# EAGLE design TRV_RFM23_V0.1 (EAGLE 6.3)
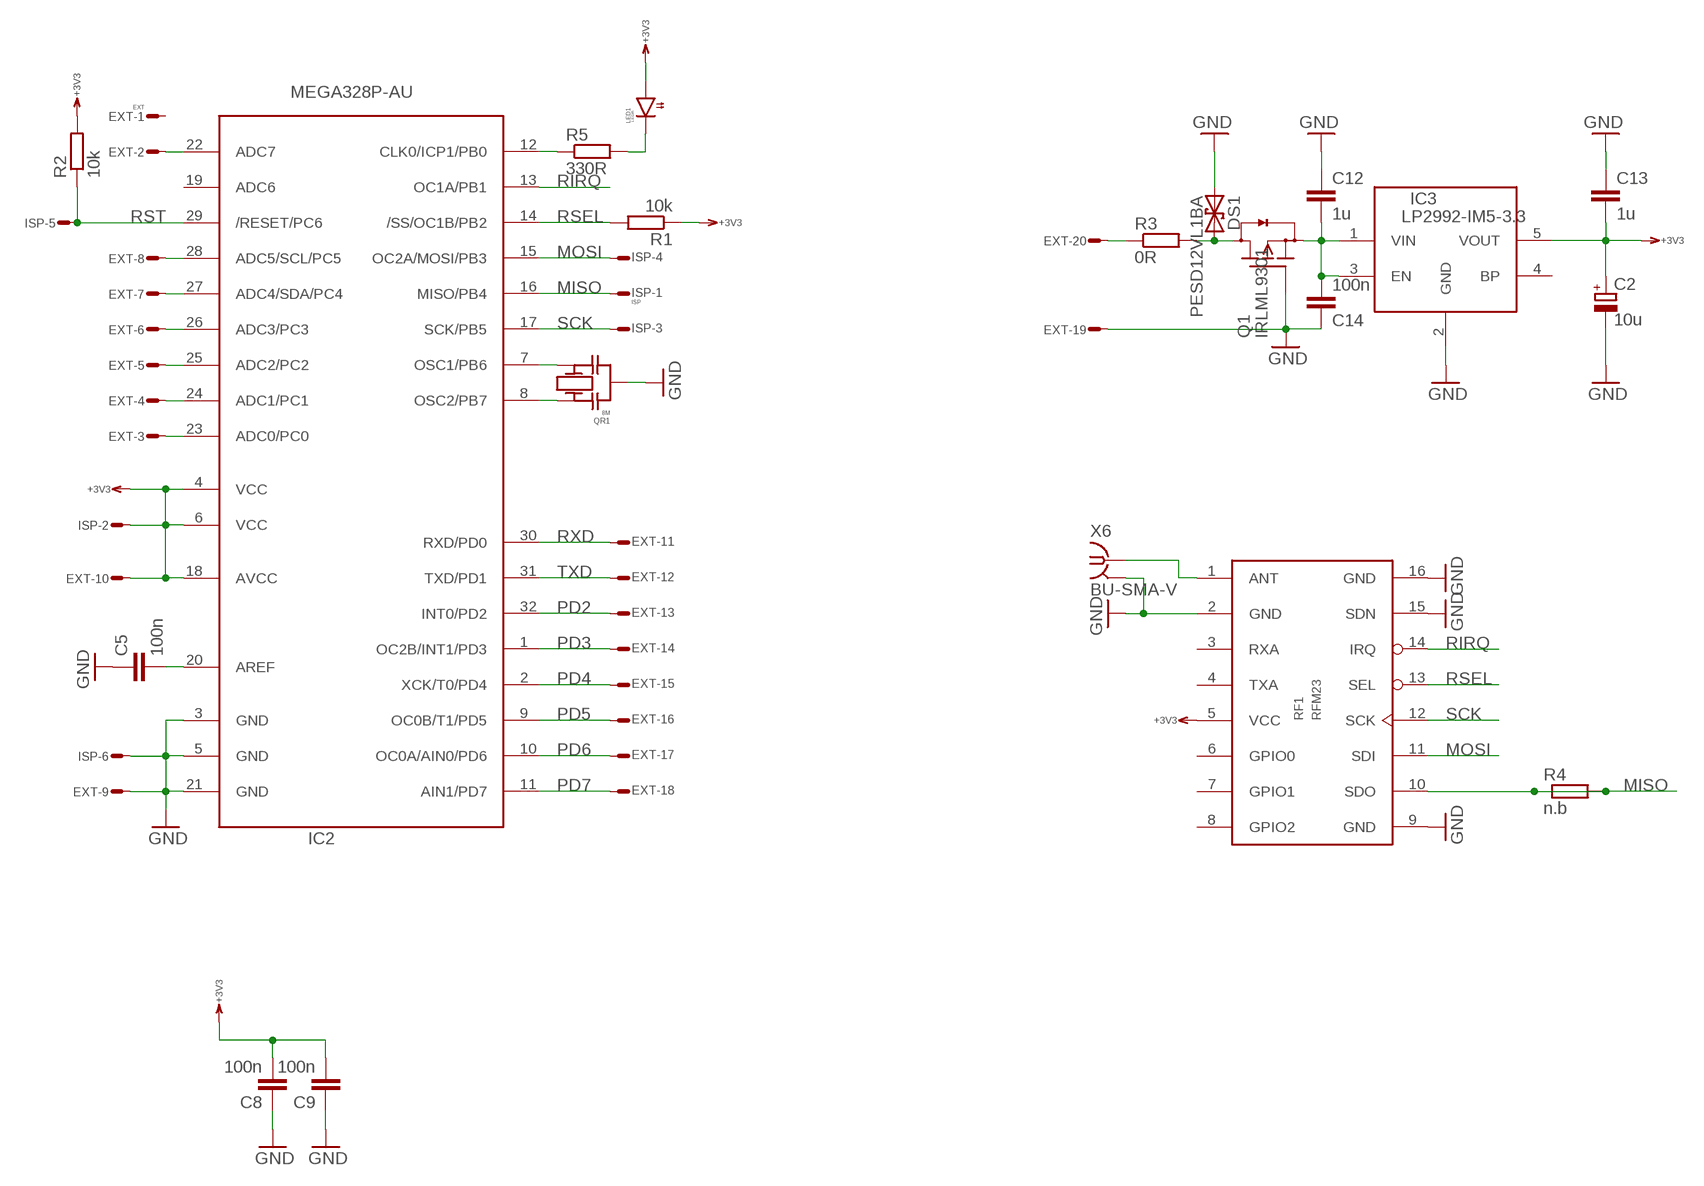
[diagram p0: schematic, sheet 1]

## Parts
C2  10u  C_POLSMCB  [SMC_B]
C5  100n  C0603  [0603]
C8  100n  C0603  [0603]
C9  100n  C0603  [0603]
C12  1u  C0603  [0603]
C13  1u  C0603  [0603]
C14  100n  C0603  [0603]
DS1  PESD12VL1BA  TVS-U323  [SOD323]
EXT  EXT  ML20SE  [ML20S]
IC2  MEGA328P-AU  MEGA168PA  [TQFP32-08]
IC3  LP2992-IM5-3.3  LDO  [SOT23-5]
ISP  ISP  ML6ES  [ML6S]
LED1  LEDR  LED0805  [0805]
Q1  IRLML9301  FET-PDSOT23  [SOT23]
QR1  8M  QRCR  [CR]
R1  10k  R0603  [0603]
R2  10k  R0603  [0603]
R3  0R  R0603  [0603]
R4  n.b  R0603  [0603]
R5  330R  R0603  [0603]
RF1  RFM23  RFM22S1  [RFM23B]
X6  BU-SMA-V  [BU-SMA-V]

## Nets
+3V3: C2.+ C8.2 C9.2 C13.2 EXT.10 IC2.4(VCC) IC2.6(VCC) IC2.18(AVCC) IC3.5(VOUT) ISP.2 LED1.C(A) R1.1 R2.2 RF1.5(VCC)
GND: C2.- C5.1 C8.1 C9.1 C12.1 C13.1 C14.1 DS1.A EXT.9 EXT.19 IC2.3(GND) IC2.5(GND) IC2.21(GND) IC3.2(GND) ISP.6 Q1.1(G) QR1.M RF1.2(GND) RF1.9(GND) RF1.15(SDN) RF1.16(GND) X6.2(GND)
LED: IC2.12(CLK0/ICP1/PB0) R5.1
MISO: IC2.16(MISO/PB4) ISP.1 R4.1 R4.2 RF1.10(SDO)
MOSI: IC2.15(OC2A/MOSI/PB3) ISP.4 RF1.11(SDI)
N$1: RF1.1(ANT) X6.1
N$3: EXT.2 IC2.22(ADC7)
N$5: DS1.C Q1.3(D) R3.2
N$6: C5.2 IC2.20(AREF)
N$7: IC2.8(OSC2/PB7) QR1.1
N$8: IC2.7(OSC1/PB6) QR1.2
N$9: EXT.20 R3.1
N$12: C12.2 C14.2 IC3.1(VIN) IC3.3(EN) Q1.2(S)
N$21: LED1.A(C) R5.2
PC0: EXT.3 IC2.23(ADC0/PC0)
PC1: EXT.4 IC2.24(ADC1/PC1)
PC2: EXT.5 IC2.25(ADC2/PC2)
PC3: EXT.6 IC2.26(ADC3/PC3)
PC4: EXT.7 IC2.27(ADC4/SDA/PC4)
PC5: EXT.8 IC2.28(ADC5/SCL/PC5)
PD2: EXT.13 IC2.32(INT0/PD2)
PD3: EXT.14 IC2.1(OC2B/INT1/PD3)
PD4: EXT.15 IC2.2(XCK/T0/PD4)
PD5: EXT.16 IC2.9(OC0B/T1/PD5)
PD6: EXT.17 IC2.10(OC0A/AIN0/PD6)
PD7: EXT.18 IC2.11(AIN1/PD7)
RIRQ: IC2.13(OC1A/PB1) RF1.14(IRQ)
RSEL: IC2.14(/SS/OC1B/PB2) R1.2 RF1.13(SEL)
RST: IC2.29(/RESET/PC6) ISP.5 R2.1
RXD: EXT.11 IC2.30(RXD/PD0)
SCK: IC2.17(SCK/PB5) ISP.3 RF1.12(SCK)
TXD: EXT.12 IC2.31(TXD/PD1)
Unconnected: EXT.1 IC2.19(ADC6) IC3.4(BP) RF1.3(RXA) RF1.4(TXA) RF1.6(GPIO0) RF1.7(GPIO1) RF1.8(GPIO2)

## Power pins joined to a net without a drawn wire
GND: X6.3(GND) X6.4(GND) X6.5(GND)

## Library data of the parts
C2 = RCL:C_POL: POLARIZED CAPACITOR, European symbol
C5 C8 C9 C12-C14 = RCL:C: Capacitor SMD
DS1 = Diode:TVS-U: DIODE
EXT = Conn:ML20?E: HARTING
IC2 = atmel:MEGA168P: MCU, 4/8/16k, TQFP32
IC3 = DCDC:LDO
ISP = Conn:ML6E: HARTING
LED1 = Optic:LED
Q1 = Transistor:FET-PD
QR1 = QUARTZ:QR
R1-R5 = RCL:R: Resistor SMD
RF1 = RF:RFM22
X6 = Conn:BU-SMA-V: FEMALE SMA CONNECTOR Radiall distributor RS 112-3794; OC_FARNELL: unknown; OC_NEWARK: unknown

## Board
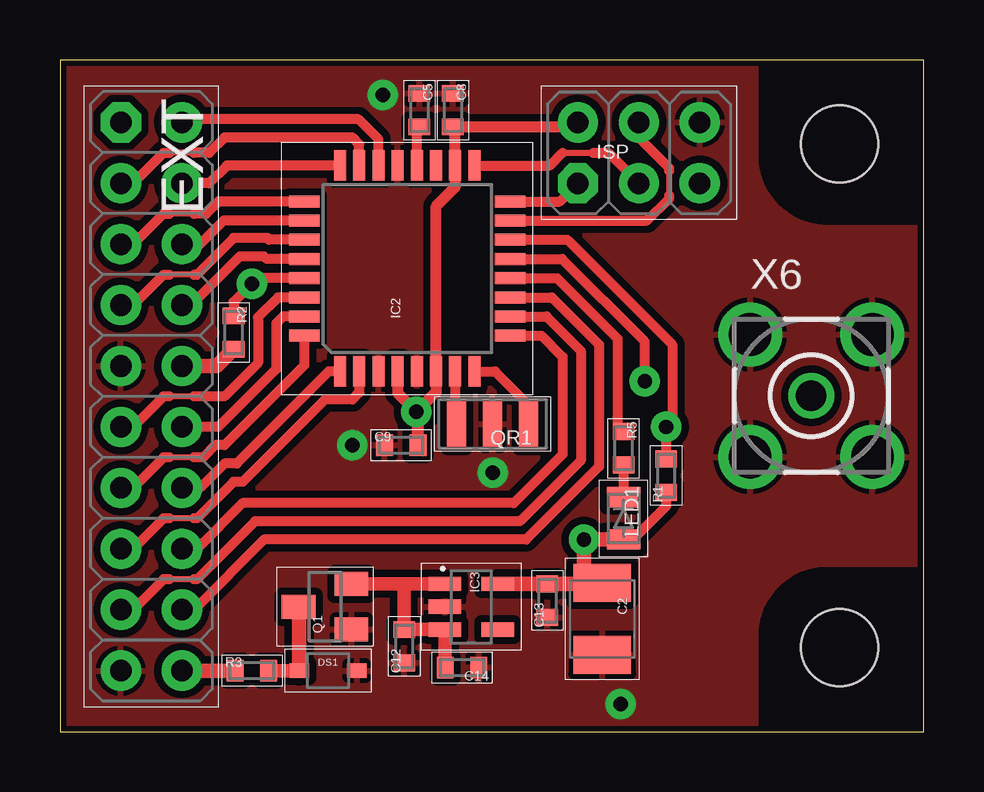
[diagram p1: board, top side]
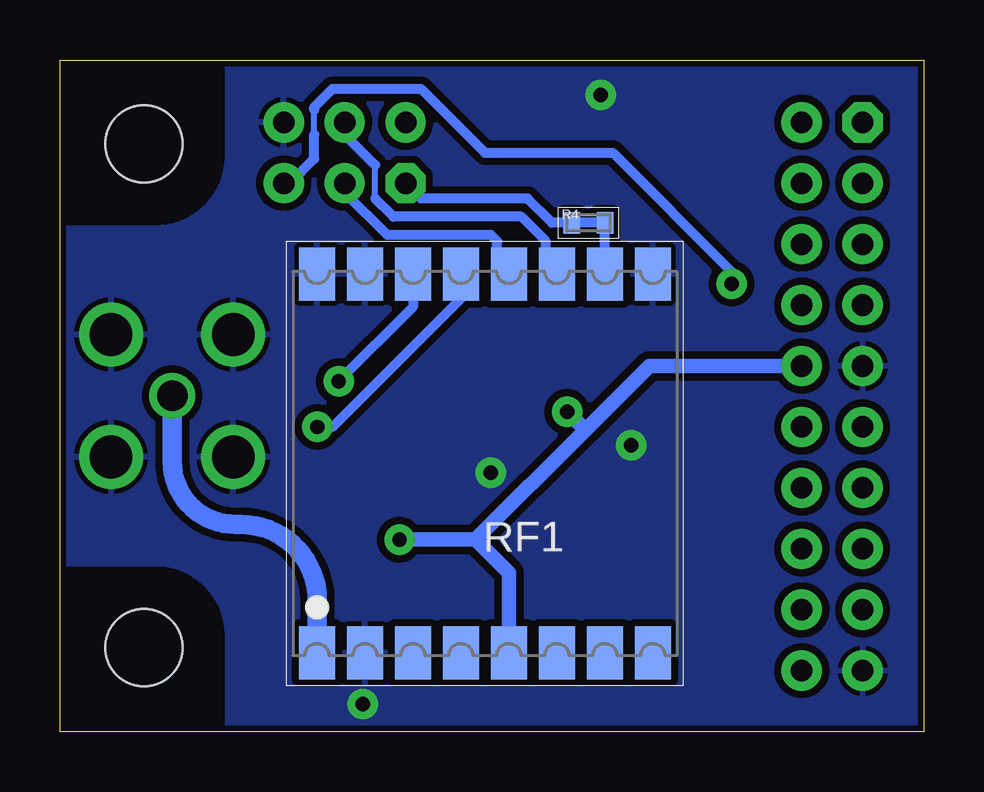
[diagram p2: board, bottom side, seen from below]

Size 36 x 28 mm. Coordinates in mm from the lower left corner, seen from the top.
Outline: 0,0 36,0 36,28 0,28 0,0
Copper layers (1*16): Top 0.035mm / dielectric 1.5mm / Bottom 0.035mm
Design rules "default *": minimum track width 8mil, minimum drill 0.3mm, track to track 12mil, track to pad 12mil, pad to pad 10mil, via to via 12mil, smd to smd 10mil, copper to edge 10mil, drill to drill 8mil, minimum pad ring 5mil, minimum via ring 8mil, stop-mask expansion 4mil, vias tented up to drill 25mil, thermal gap 8mil
Holes 3.2 mm at 32.5,24.5 32.5,3.5

### Footprints (pad centres in the part's own frame; a part is rotated, then mirrored left to right if it is on the bottom)
SMC_B = smd 1.6 x 2.4: + -1.5,0; - 1.5,0
0603 = smd 0.7 x 0.9: 1 -0.697,0; 2 0.697,0
SOD323 = smd 0.8 x 0.6: A 1.2,0; C -1.2,0
ML20S = drill 0.9 pad 1.676 octagon: 1 -11.43,-1.27 | drill 0.9 pad 1.676: 2 -11.43,1.27; 3 -8.89,-1.27; 4 -8.89,1.27; 5 -6.35,-1.27; 6 -6.35,1.27; 7 -3.81,-1.27; 8 -3.81,1.27; 9 -1.27,-1.27; 10 -1.27,1.27; 11 1.27,-1.27; 12 1.27,1.27; 13 3.81,-1.27; 14 3.81,1.27; 15 6.35,-1.27; 16 6.35,1.27; 17 8.89,-1.27; 18 8.89,1.27; 19 11.43,-1.27; 20 11.43,1.27
TQFP32-08 = smd 1.27 x 0.5: 1 -4.293,2.8; 2 -4.293,2; 3 -4.293,1.2; 4 -4.293,0.4; 5 -4.293,-0.4; 6 -4.293,-1.2; 7 -4.293,-2; 8 -4.293,-2.8; 17 4.293,-2.8; 18 4.293,-2; 19 4.293,-1.2; 20 4.293,-0.4; 21 4.293,0.4; 22 4.293,1.2; 23 4.293,2; 24 4.293,2.8 | smd 0.5 x 1.27: 9 -2.8,-4.293; 10 -2,-4.293; 11 -1.2,-4.293; 12 -0.4,-4.293; 13 0.4,-4.293; 14 1.2,-4.293; 15 2,-4.293; 16 2.8,-4.293; 25 2.8,4.293; 26 2,4.293; 27 1.2,4.293; 28 0.4,4.293; 29 -0.4,4.293; 30 -1.2,4.293; 31 -2,4.293; 32 -2.8,4.293
SOT23-5 = smd 0.6 x 1.35: 1 -0.95,-1.101; 2 0,-1.101; 3 0.95,-1.101; 4 0.95,1.101; 5 -0.951,1.101
ML6S = drill 0.9 pad 1.676 octagon: 1 -2.54,-1.27 | drill 0.9 pad 1.676: 2 -2.54,1.27; 3 0,-1.27; 4 0,1.27; 5 2.54,-1.27; 6 2.54,1.27
0805 = smd 0.85 x 1.4: A 0.88,0; C -0.88,0
SOT23 = smd 1 x 1.4: 1 -0.95,-1.1; 2 0.95,-1.1; 3 0,1.1
CR = smd 0.8 x 2: 1 -1.5,0; 2 1.5,0; M 0,0
RFM23B = smd 2.2 x 1.5: 1 -7.9,7; 2 -7.9,5; 3 -7.9,3; 4 -7.9,1; 5 -7.9,-1; 6 -7.9,-3; 7 -7.9,-5; 8 -7.9,-7; 9 7.9,-7; 10 7.9,-5; 11 7.9,-3; 12 7.9,-1; 13 7.9,1; 14 7.9,3; 15 7.9,5; 16 7.9,7
BU-SMA-V = drill 1.27: 1 0,0 | drill 1.778: 2 -2.55,2.55; 3 2.55,2.55; 4 2.55,-2.55; 5 -2.55,-2.55

### Placement (x,y rotation side)
C2  22.61,4.7 270 top
C5  14.99,25.91 270 top
C8  16.38,25.91 270 top
C9  14.22,11.94 0 top
C12  14.35,3.56 90 top
C13  20.32,5.46 90 top
C14  16.76,2.67 180 top
DS1  11.18,2.54 0 top
EXT  3.81,13.97 270 top
IC2  14.48,19.3 90 top
IC3  17.14,5.21 270 top
ISP  24.13,24.13 0 top
LED1  23.5,8.89 90 top
Q1  11.05,5.21 90 top
QR1  18.03,12.83 180 top
R1  25.27,10.67 90 top
R2  7.24,16.64 270 top
R3  8,2.54 0 top
R4  13.97,21.21 0 bottom
R5  23.5,11.81 270 top
RF1  18.29,11.18 90 bottom
X6  31.32,14 0 top

### Tracks (layer width: path | path; a pad name or v marks a point on that pad's centre or on a via)
+3V3  (via drill 0.6 pad 1.27)
  Top 0.406: LED1.C 23.55,8.07 23.94,8.07 25.27,9.4 R1.1
  Top 0.457: IC2.4 14.08,14.12 v14.86,13.34 15.68,14.15 IC2.6 15.68,21.9 16.48,22.7 IC2.18 16.48,25.12 C8.2 21.4,25.21 ISP.2
  Top 0.508: C9.2 14.92,13.27 v14.86,13.34
  Top 0.61: EXT.10 6.54,15.24 R2.2 | 21.97,6.16 C13.2 IC3.5 | 21.97,6.16 22.57,6.16 C2.+ | 21.97,6.16 21.84,6.29 v21.84,8 21.85,8.01 LED1.C
  Bottom 0.61: 14.1,12.57 11.43,15.24 EXT.10 | v21.84,8 18.67,8 | 14.1,12.57 18.67,8 | v14.86,13.34 14.1,12.57 | RF1.5 17.29,6.62 18.67,8
GND  (via drill 0.6 pad 1.27)
  other vias: 18.03,10.79 12.19,11.94 13.46,26.54 23.37,1.14
  pour Top: 0,0 29,0 29,4 arc-90 32,7 36,7 36,21 32,21 arc-90 29,24 29,28 0,28
  pour Bottom: 0,0 29,0 29,4 arc-90 32,7 36,7 36,21 32,21 arc-90 29,24 29,28 0,28
LED
  Top 0.406: IC2.12 20.72,18.9 23.24,16.38 23.24,12.76 R5.1
MISO
  Top 0.406: IC2.16 20.83,22.1 ISP.1
  Bottom 0.406: RF1.10 13.29,21.19 R4.2 R4.1 15.49,21.21 16.51,22.23 20.95,22.23 ISP.1
MOSI
  Top 0.254: 25.4,22.35 25.4,23.37
  Top 0.406: IC2.15 24.48,21.3 25.4,22.23 25.4,22.35 | 25.4,23.37 25.4,23.5 24.13,24.77 ISP.4
  Bottom 0.254: 22.86,22.23 22.86,23.62
  Bottom 0.406: 22.86,22.23 22.1,21.46 16.76,21.46 15.75,20.45 15.75,19.81 15.29,19.35 RF1.11 | 22.86,23.62 24.13,24.89 ISP.4
N$1
  Bottom 0.813: X6.1 31.32,11.26 arc-90 28.7,8.64 28.45,8.64 arc90 25.27,5.46 25.27,3.29 arc90 RF1.1
N$3
  Top 0.406: IC2.22 13.28,24.7 12.45,25.53 5.21,25.53 EXT.2
N$5
  Top 0.559: DS1.C R3.2
  Top 0.61: DS1.C 9.98,5.18 Q1.3
N$6
  Top 0.406: IC2.20 14.88,25.1 C5.2
N$7
  Top 0.406: IC2.8 18.14,15.01 19.43,13.72 19.43,12.93 QR1.1
N$8
  Top 0.406: IC2.7 16.48,12.88 QR1.2
N$9
  Top 0.61: EXT.20 R3.1
N$12
  Top 0.559: IC3.1 14.35,6.16 | 14.35,6.16 Q1.2 | Q1.2 | 14.35,6.16 C12.2 IC3.3 16.04,2.69 C14.2
N$21
  Top 0.406: R5.2 LED1.A
PC0
  Top 0.254: 5.59,24.13 4.57,24.13
  Top 0.406: IC2.23 12.48,24.48 12.19,24.77 6.86,24.77 6.22,24.13 5.59,24.13 | EXT.3 3.05,22.86 4.32,24.13 4.57,24.13
PC1
  Top 0.406: IC2.24 6.96,23.6 6.22,22.86 EXT.4
PC2
  Top 0.254: 5.59,21.59 4.57,21.59
  Top 0.406: 5.59,21.59 6.1,21.59 6.61,22.1 IC2.25 | EXT.5 3.05,20.32 4.32,21.59 4.57,21.59
PC3
  Top 0.406: EXT.6 5.84,20.32 6.83,21.3 IC2.26
PC4
  Top 0.254: 5.59,19.05 4.57,19.05
  Top 0.406: 5.59,19.05 5.71,19.05 7.24,20.57 8.64,20.57 8.71,20.5 IC2.27 | EXT.7 3.05,17.78 4.32,19.05 4.57,19.05
PC5
  Top 0.406: EXT.8 5.46,17.78 7.49,19.81 8.51,19.81 8.62,19.7 IC2.28
PD2
  Top 0.254: 5.59,11.43 4.57,11.43
  Top 0.406: 4.57,11.43 4.32,11.43 3.05,10.16 EXT.13 | IC2.32 10.19,15.27 6.86,11.94 6.48,11.94 5.97,11.43 5.59,11.43
PD3
  Top 0.406: EXT.14 5.84,10.16 6.86,11.18 7.37,11.18 11.2,15.01 IC2.1
PD4
  Top 0.254: 5.59,8.89 4.57,8.89
  Top 0.406: IC2.2 12.48,14.13 12.19,13.84 11.05,13.84 7.62,10.41 7.24,10.41 5.71,8.89 5.59,8.89 | 4.57,8.89 4.32,8.89 3.05,7.62 EXT.15
PD5
  Top 0.406: IC2.9 20.07,16.5 20.95,15.62 20.95,11.56 18.92,9.53 7.62,9.53 5.71,7.62 EXT.16
PD6
  Top 0.254: 5.59,6.35 4.57,6.35
  Top 0.406: IC2.10 20.29,17.3 21.72,15.88 21.72,11.3 19.18,8.76 8.13,8.76 5.71,6.35 5.59,6.35 | 4.57,6.35 4.32,6.35 3.05,5.08 EXT.17
PD7
  Top 0.406: IC2.11 20.5,18.1 22.48,16.13 22.48,11.05 19.43,8 8.51,8 5.59,5.08 EXT.18
RIRQ  (via drill 0.6 pad 1.27)
  Top 0.406: v24.38,14.61 24.38,16.26 20.94,19.7 IC2.13
  Bottom 0.406: RF1.14 21.29,17.7 v24.38,14.61
RSEL  (via drill 0.6 pad 1.27)
  Top 0.406: IC2.14 21.15,20.5 25.53,16.13 25.53,12.95 v25.27,12.7 R1.2
  Bottom 0.406: v25.27,12.7 24.64,12.7 19.29,18.05 RF1.13
RST  (via drill 0.6 pad 1.27)
  Top 0.406: IC2.29 8.24,18.9 v8,18.67 7.24,17.91 R2.1
  Bottom 0.254: 25.4,24.89 25.4,25.91
  Bottom 0.406: ISP.5 26.42,22.86 25.4,23.88 25.4,24.89 | 25.4,25.91 25.4,26.04 24.64,26.8 20.95,26.8 18.29,24.13 12.95,24.13 8,19.18 v8,18.67
RXD
  Top 0.254: 5.59,13.97 4.57,13.97
  Top 0.406: IC2.30 9.09,18.1 8.26,17.27 8.26,15.37 6.86,13.97 5.59,13.97 | 4.57,13.97 4.32,13.97 3.05,12.7 EXT.11
SCK
  Top 0.254: 20.95,24.13 22.23,24.13
  Top 0.406: 22.23,24.13 22.86,24.13 ISP.3 | IC2.17 20.42,23.6 20.95,24.13
  Bottom 0.406: ISP.3 24.13,22.48 22.35,20.7 18.03,20.7 17.78,20.45 17.78,19.81 17.29,19.32 RF1.12
TXD
  Top 0.406: IC2.31 9.3,17.3 9.02,17.02 9.02,15.11 6.6,12.7 EXT.12